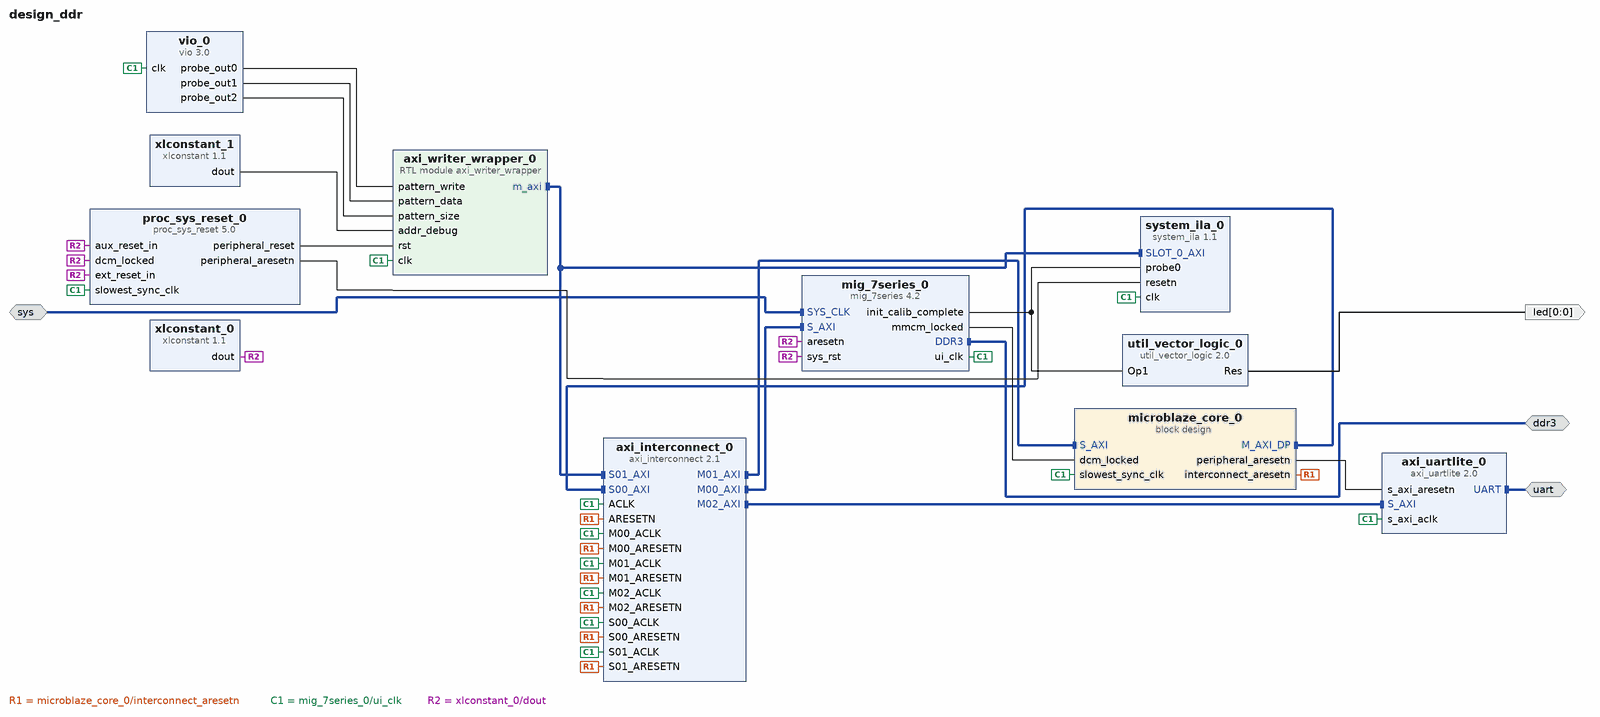
[diagram p0: block diagram of the top level]
# Vivado block design design_ddr, xc7k325tffg676-2, Vivado 2024.2
create_bd_design design_ddr

create_bd_intf_port -mode Slave -vlnv xilinx.com:interface:diff_clock_rtl:1.0 sys
set_property -dict {CONFIG.FREQ_HZ 200000000} [get_bd_intf_ports sys]
create_bd_intf_port -mode Master -vlnv xilinx.com:interface:ddrx_rtl:1.0 ddr3
create_bd_intf_port -mode Master -vlnv xilinx.com:interface:uart_rtl:1.0 uart
create_bd_port -dir O -from 0 -to 0 led

create_bd_cell -type ip -vlnv xilinx.com:ip:mig_7series:4.2 mig_7series_0
set_property -dict [list \
  CONFIG.BOARD_MIG_PARAM Custom \
  CONFIG.RESET_BOARD_INTERFACE Custom \
  CONFIG.XML_INPUT_FILE mig_a.prj \
] [get_bd_cells mig_7series_0]
create_bd_cell -type ip -vlnv xilinx.com:ip:util_vector_logic:2.0 util_vector_logic_0
set_property -dict {CONFIG.C_OPERATION not CONFIG.C_SIZE 1} [get_bd_cells util_vector_logic_0]
create_bd_cell -type ip -vlnv xilinx.com:ip:system_ila:1.1 system_ila_0
set_property -dict [list \
  CONFIG.C_MON_TYPE MIX \
  CONFIG.C_NUM_MONITOR_SLOTS 1 \
  CONFIG.C_NUM_OF_PROBES 1 \
  CONFIG.C_PROBE0_TYPE 0 \
  CONFIG.C_SLOT_0_APC_EN 0 \
  CONFIG.C_SLOT_0_AXI_AR_SEL_DATA 0 \
  CONFIG.C_SLOT_0_AXI_AR_SEL_TRIG 0 \
  CONFIG.C_SLOT_0_AXI_AW_SEL_DATA 1 \
  CONFIG.C_SLOT_0_AXI_AW_SEL_TRIG 1 \
  CONFIG.C_SLOT_0_AXI_B_SEL_DATA 1 \
  CONFIG.C_SLOT_0_AXI_B_SEL_TRIG 1 \
  CONFIG.C_SLOT_0_AXI_R_SEL_DATA 0 \
  CONFIG.C_SLOT_0_AXI_R_SEL_TRIG 0 \
  CONFIG.C_SLOT_0_AXI_W_SEL_DATA 1 \
  CONFIG.C_SLOT_0_AXI_W_SEL_TRIG 1 \
  CONFIG.C_SLOT_0_INTF_TYPE xilinx.com:interface:aximm_rtl:1.0 \
] [get_bd_cells system_ila_0]
create_bd_cell -type ip -vlnv xilinx.com:ip:xlconstant:1.1 xlconstant_0
create_bd_cell -type module -reference axi_writer_wrapper axi_writer_wrapper_0
create_bd_cell -type ip -vlnv xilinx.com:ip:proc_sys_reset:5.0 proc_sys_reset_0
create_bd_cell -type ip -vlnv xilinx.com:ip:vio:3.0 vio_0
set_property -dict [list \
  CONFIG.C_NUM_PROBE_OUT 3 \
  CONFIG.C_PROBE_IN0_WIDTH 32 \
  CONFIG.C_PROBE_OUT1_WIDTH 8 \
  CONFIG.C_PROBE_OUT2_WIDTH 16 \
] [get_bd_cells vio_0]
create_bd_cell -type ip -vlnv xilinx.com:ip:xlconstant:1.1 xlconstant_1
set_property -dict {CONFIG.CONST_VAL 0 CONFIG.CONST_WIDTH 28} [get_bd_cells xlconstant_1]
create_bd_cell -type container -reference microblaze_core microblaze_core_0
set_property -dict [list \
  CONFIG.ACTIVE_SIM_BD microblaze_core.bd \
  CONFIG.ACTIVE_SYNTH_BD microblaze_core.bd \
  CONFIG.ENABLE_DFX 0 \
  CONFIG.LIST_SIM_BD microblaze_core.bd \
  CONFIG.LIST_SYNTH_BD microblaze_core.bd \
  CONFIG.LOCK_PROPAGATE 0 \
] [get_bd_cells microblaze_core_0]
create_bd_cell -type ip -vlnv xilinx.com:ip:axi_interconnect:2.1 axi_interconnect_0
set_property -dict {CONFIG.NUM_MI 3 CONFIG.NUM_SI 2} [get_bd_cells axi_interconnect_0]
create_bd_cell -type ip -vlnv xilinx.com:ip:axi_uartlite:2.0 axi_uartlite_0

# ---- connections ----

connect_bd_intf_net [get_bd_intf_pins axi_interconnect_0/M00_AXI] [get_bd_intf_pins mig_7series_0/S_AXI]
connect_bd_intf_net [get_bd_intf_pins axi_interconnect_0/M01_AXI] [get_bd_intf_pins microblaze_core_0/S_AXI]
connect_bd_intf_net [get_bd_intf_pins axi_interconnect_0/M02_AXI] [get_bd_intf_pins axi_uartlite_0/S_AXI]
connect_bd_intf_net [get_bd_intf_pins axi_uartlite_0/UART] [get_bd_intf_ports uart]
connect_bd_intf_net -intf_net axi_writer_wrapper_0_m_axi [get_bd_intf_pins axi_writer_wrapper_0/m_axi] [get_bd_intf_pins axi_interconnect_0/S01_AXI]
connect_bd_intf_net [get_bd_intf_pins axi_writer_wrapper_0/m_axi] [get_bd_intf_pins system_ila_0/SLOT_0_AXI]
connect_bd_intf_net [get_bd_intf_pins microblaze_core_0/M_AXI_DP] [get_bd_intf_pins axi_interconnect_0/S00_AXI]
connect_bd_intf_net [get_bd_intf_pins mig_7series_0/DDR3] [get_bd_intf_ports ddr3]
connect_bd_intf_net [get_bd_intf_pins mig_7series_0/SYS_CLK] [get_bd_intf_ports sys]
connect_bd_net [get_bd_pins microblaze_core_0/interconnect_aresetn] \
  [get_bd_pins axi_interconnect_0/ARESETN] [get_bd_pins axi_interconnect_0/S00_ARESETN] \
  [get_bd_pins axi_interconnect_0/M00_ARESETN] [get_bd_pins axi_interconnect_0/M01_ARESETN] \
  [get_bd_pins axi_interconnect_0/S01_ARESETN] [get_bd_pins axi_interconnect_0/M02_ARESETN]
connect_bd_net [get_bd_pins microblaze_core_0/peripheral_aresetn] [get_bd_pins axi_uartlite_0/s_axi_aresetn]
connect_bd_net -net mig_7series_0_init_calib_complete [get_bd_pins mig_7series_0/init_calib_complete] \
  [get_bd_pins util_vector_logic_0/Op1] [get_bd_pins system_ila_0/probe0]
connect_bd_net [get_bd_pins mig_7series_0/mmcm_locked] [get_bd_pins microblaze_core_0/dcm_locked]
connect_bd_net [get_bd_pins mig_7series_0/ui_clk] \
  [get_bd_pins system_ila_0/clk] [get_bd_pins axi_writer_wrapper_0/clk] [get_bd_pins proc_sys_reset_0/slowest_sync_clk] \
  [get_bd_pins vio_0/clk] [get_bd_pins microblaze_core_0/slowest_sync_clk] [get_bd_pins axi_interconnect_0/S01_ACLK] \
  [get_bd_pins axi_interconnect_0/M01_ACLK] [get_bd_pins axi_interconnect_0/M00_ACLK] \
  [get_bd_pins axi_interconnect_0/S00_ACLK] [get_bd_pins axi_interconnect_0/ACLK] [get_bd_pins axi_uartlite_0/s_axi_aclk] \
  [get_bd_pins axi_interconnect_0/M02_ACLK]
connect_bd_net [get_bd_pins proc_sys_reset_0/peripheral_aresetn] [get_bd_pins system_ila_0/resetn]
connect_bd_net [get_bd_pins proc_sys_reset_0/peripheral_reset] [get_bd_pins axi_writer_wrapper_0/rst]
connect_bd_net [get_bd_pins util_vector_logic_0/Res] [get_bd_ports led]
connect_bd_net [get_bd_pins vio_0/probe_out0] [get_bd_pins axi_writer_wrapper_0/pattern_write]
connect_bd_net [get_bd_pins vio_0/probe_out1] [get_bd_pins axi_writer_wrapper_0/pattern_data]
connect_bd_net [get_bd_pins vio_0/probe_out2] [get_bd_pins axi_writer_wrapper_0/pattern_size]
connect_bd_net [get_bd_pins xlconstant_0/dout] \
  [get_bd_pins mig_7series_0/sys_rst] [get_bd_pins mig_7series_0/aresetn] [get_bd_pins proc_sys_reset_0/ext_reset_in] \
  [get_bd_pins proc_sys_reset_0/aux_reset_in] [get_bd_pins proc_sys_reset_0/dcm_locked]
connect_bd_net [get_bd_pins xlconstant_1/dout] [get_bd_pins axi_writer_wrapper_0/addr_debug]
set_property HDL_ATTRIBUTE.DEBUG true [get_bd_intf_nets axi_writer_wrapper_0_m_axi]
set_property HDL_ATTRIBUTE.MARK_DEBUG true [get_bd_intf_nets axi_writer_wrapper_0_m_axi]
set_property HDL_ATTRIBUTE.DEBUG true [get_bd_nets mig_7series_0_init_calib_complete]
set_property HDL_ATTRIBUTE.MARK_DEBUG true [get_bd_nets mig_7series_0_init_calib_complete]

# ---- address map ----
assign_bd_address -offset 0x00000000 -range 256M -target_address_space [get_bd_addr_spaces axi_writer_wrapper_0/m_axi] [get_bd_addr_segs mig_7series_0/memmap/memaddr]
assign_bd_address -offset 0x40600000 -range 64K -target_address_space [get_bd_addr_spaces axi_writer_wrapper_0/m_axi] [get_bd_addr_segs axi_uartlite_0/S_AXI/Reg]
assign_bd_address -offset 0x41400000 -range 4K -target_address_space [get_bd_addr_spaces axi_writer_wrapper_0/m_axi] [get_bd_addr_segs microblaze_core_0/mdm_0/S_AXI/Reg]
assign_bd_address -offset 0x00000000 -range 256M -target_address_space [get_bd_addr_spaces microblaze_core_0/microblaze_0/Data] [get_bd_addr_segs mig_7series_0/memmap/memaddr]
assign_bd_address -offset 0x40600000 -range 64K -target_address_space [get_bd_addr_spaces microblaze_core_0/microblaze_0/Data] [get_bd_addr_segs axi_uartlite_0/S_AXI/Reg]
assign_bd_address -offset 0x41400000 -range 4K -target_address_space [get_bd_addr_spaces microblaze_core_0/microblaze_0/Data] [get_bd_addr_segs microblaze_core_0/mdm_0/S_AXI/Reg]
assign_bd_address -offset 0x80000000 -range 256K -target_address_space [get_bd_addr_spaces microblaze_core_0/microblaze_0/Data] [get_bd_addr_segs microblaze_core_0/lmb_bram_if_cntlr_0/SLMB/Mem]
assign_bd_address -offset 0x80000000 -range 256K -target_address_space [get_bd_addr_spaces microblaze_core_0/microblaze_0/Instruction] [get_bd_addr_segs microblaze_core_0/lmb_bram_if_cntlr_1/SLMB/Mem]

validate_bd_design
save_bd_design
